# EAGLE design SSOP-28 v10 (EAGLE 6.2)
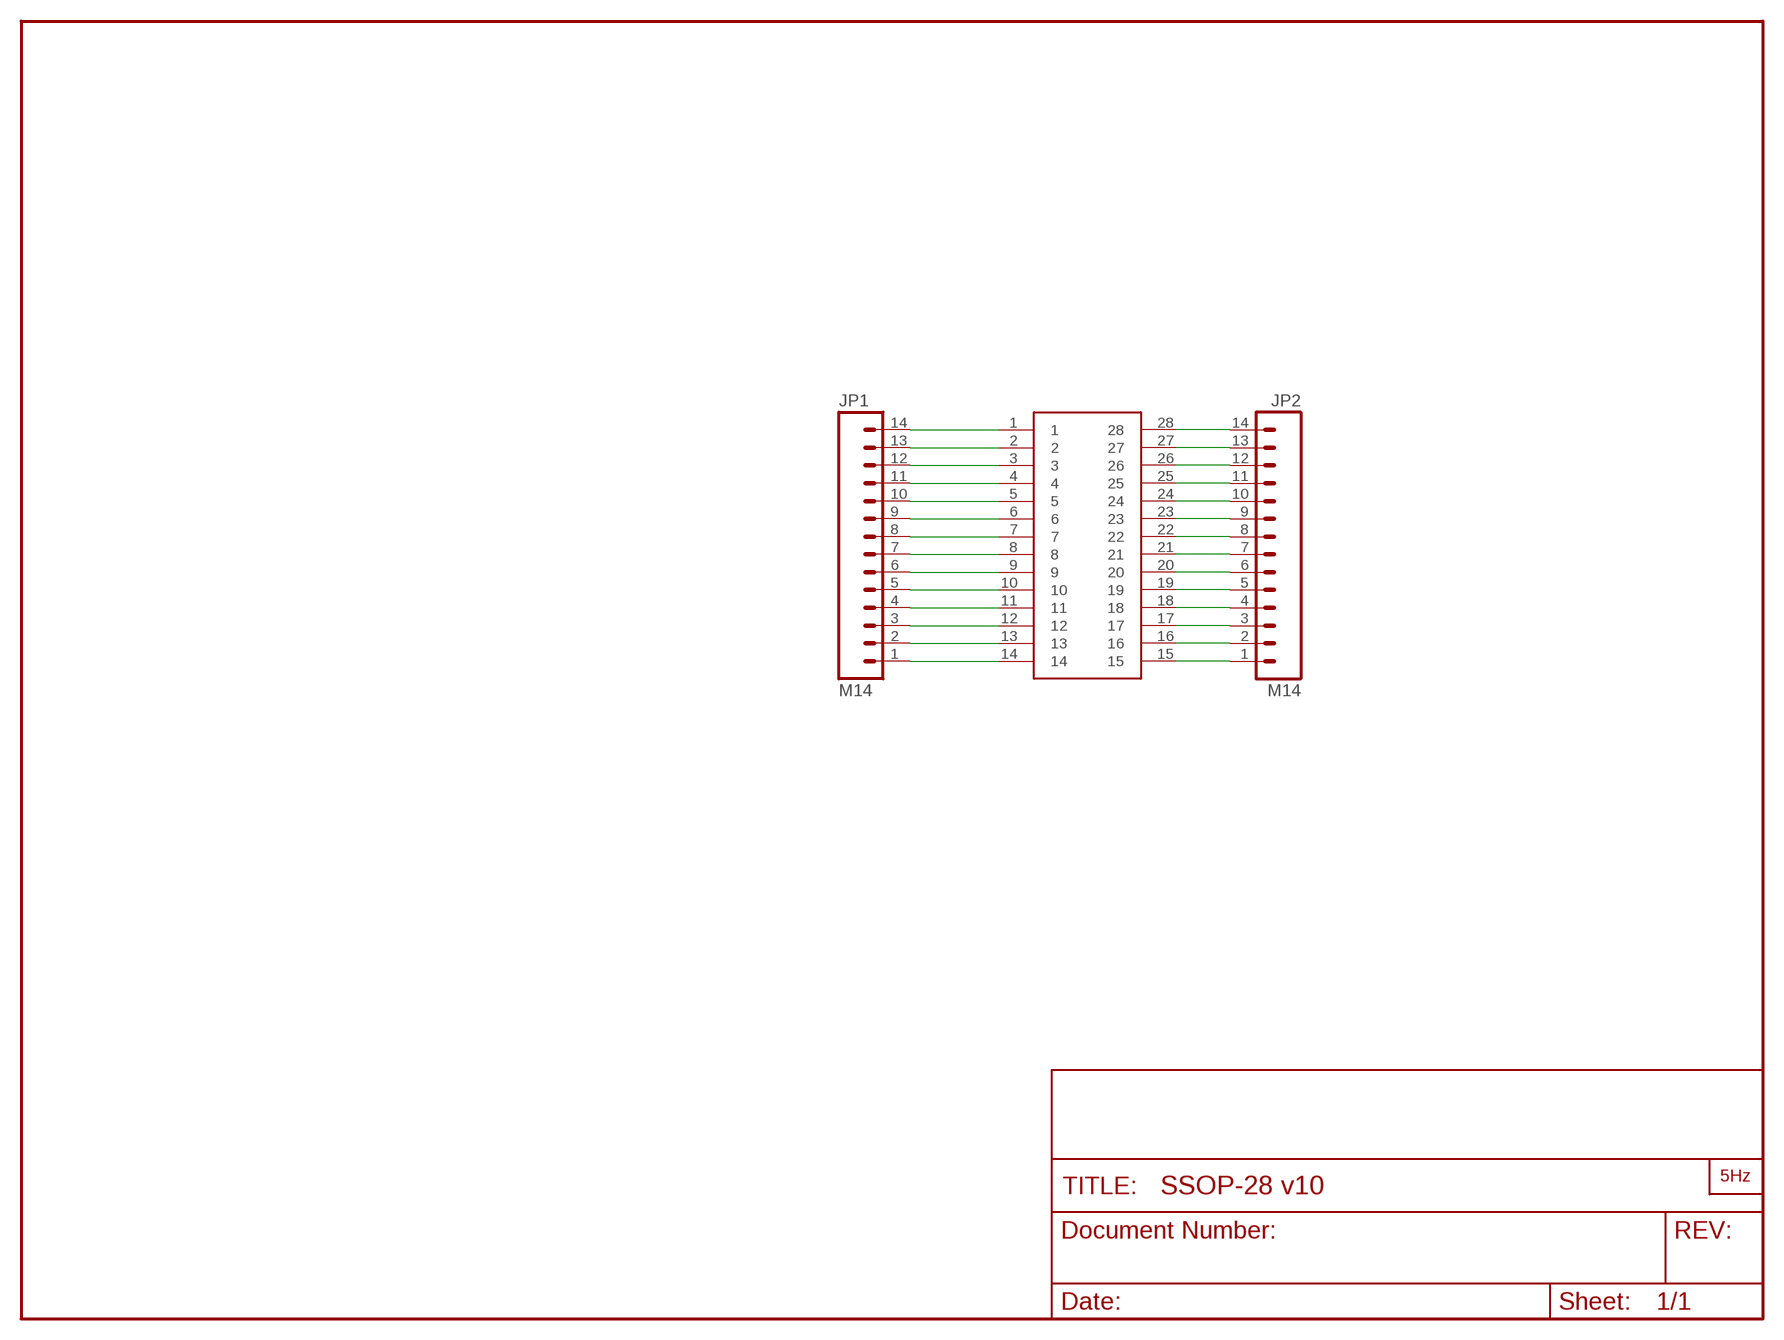
[diagram p0: schematic, sheet 1]

## Parts
JP1  M14  [1X14]
JP2  M14  [1X14]
U$1  SSOP28  [SSOP28DB]
U$2  LOGO2_SILK10MM  [LOGO2_10MM]

## Nets
N$1: JP1.1 U$1.14
N$2: JP1.2 U$1.13
N$3: JP1.3 U$1.12
N$4: JP1.4 U$1.11
N$5: JP1.5 U$1.10
N$6: JP1.6 U$1.9
N$7: JP1.7 U$1.8
N$8: JP1.8 U$1.7
N$9: JP1.9 U$1.6
N$10: JP1.10 U$1.5
N$11: JP1.11 U$1.4
N$12: JP1.12 U$1.3
N$13: JP1.13 U$1.2
N$14: JP1.14 U$1.1
N$15: JP2.1 U$1.15
N$16: JP2.2 U$1.16
N$17: JP2.3 U$1.17
N$18: JP2.4 U$1.18
N$19: JP2.5 U$1.19
N$20: JP2.6 U$1.20
N$21: JP2.7 U$1.21
N$22: JP2.8 U$1.22
N$23: JP2.9 U$1.23
N$24: JP2.10 U$1.24
N$25: JP2.11 U$1.25
N$26: JP2.12 U$1.26
N$27: JP2.13 U$1.27
N$28: JP2.14 U$1.28

## Library data of the parts
JP1 JP2 = SparkFun:M14: Header 14 Standard 14-pin 0.1" header. Use with straight break away headers (SKU : PRT-00116), right angle break away headers (PRT-00553), swiss pins (PRT-00743), machine pins (PRT-00117), and female headers (PRT-00115).
U$1 = SparkFun:SSOP28
U$2 = LOGO:LOGO2_SILK: PRINCIPAL

## Board
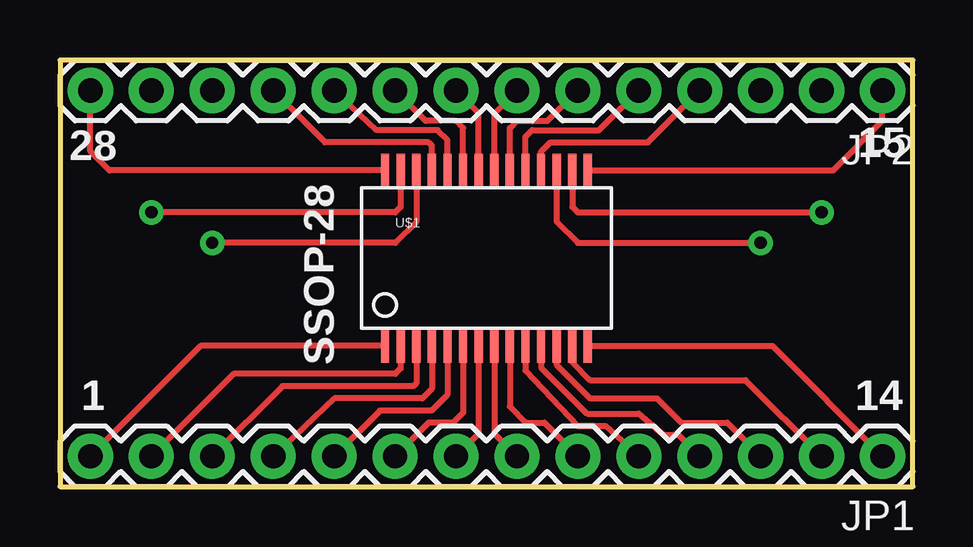
[diagram p1: board, top side]
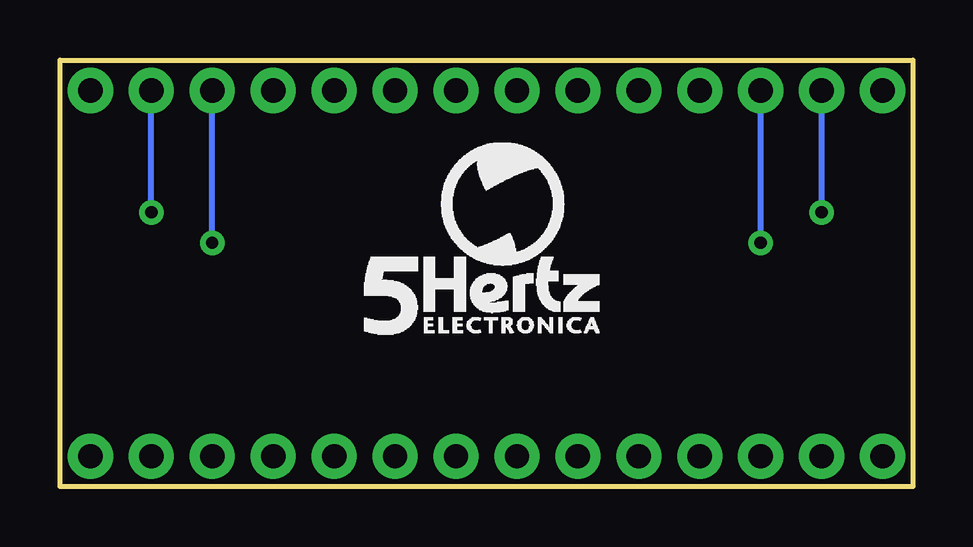
[diagram p2: board, bottom side, seen from below]

Size 35.56 x 17.78 mm. Coordinates in mm from the lower left corner, seen from the top.
Outline: 0,0 35.56,0 35.56,17.78 0,17.78 0,0
Copper layers (1*16): Top 0.035mm / dielectric 1.5mm / Bottom 0.035mm
Design rules: minimum track width 8mil, minimum drill 20mil, track to track 8mil, track to pad 8mil, pad to pad 8mil, via to via 8mil, smd to smd 8mil, copper to edge 10mil, drill to drill 8mil, minimum pad ring 12mil, minimum via ring 10mil, stop-mask expansion 4mil, vias tented up to drill 25mil, thermal gap 10mil

### Footprints (pad centres in the part's own frame; a part is rotated, then mirrored left to right if it is on the bottom)
1X14 = drill 1.016 pad 1.88: 1 0,0; 2 2.54,0; 3 5.08,0; 4 7.62,0; 5 10.16,0; 6 12.7,0; 7 15.24,0; 8 17.78,0; 9 20.32,0; 10 22.86,0; 11 25.4,0; 12 27.94,0; 13 30.48,0; 14 33.02,0
SSOP28DB = smd 0.348 x 1.397: 1 -4.225,-3.656; 2 -3.575,-3.656; 3 -2.925,-3.656; 4 -2.275,-3.656; 5 -1.625,-3.656; 6 -0.975,-3.656; 7 -0.325,-3.656; 8 0.325,-3.656; 9 0.975,-3.656; 10 1.625,-3.656; 11 2.275,-3.656; 12 2.925,-3.656; 13 3.575,-3.656; 14 4.225,-3.656; 15 4.225,3.656; 16 3.575,3.656; 17 2.925,3.656; 18 2.275,3.656; 19 1.625,3.656; 20 0.975,3.656; 21 0.325,3.656; 22 -0.325,3.656; 23 -0.975,3.656; 24 -1.625,3.656; 25 -2.275,3.656; 26 -2.925,3.656; 27 -3.575,3.656; 28 -4.225,3.656

### Placement (x,y rotation side)
JP1  34.29,1.27 180 top
JP2  34.29,16.51 180 top
U$1  17.78,9.53 0 top
U$2  22.86,6.35 0 bottom

### Tracks (layer width: path | path; a pad name or v marks a point on that pad's centre or on a via)
N$1
  Top 0.254: U$1.14 29.69,5.87 JP1.1
N$2
  Top 0.254: U$1.13 21.36,5.19 22.1,4.45 28.57,4.45 JP1.2
N$3
  Top 0.254: U$1.12 20.7,5.08 22.1,3.68 24.89,3.68 25.91,2.67 27.81,2.67 JP1.3
N$4
  Top 0.254: U$1.11 20.05,4.96 21.97,3.05 24.13,3.05 25.15,2.16 25.78,2.16 JP1.4
N$5
  Top 0.254: U$1.10 19.41,4.85 21.59,2.54 22.73,2.54 JP1.5
N$6
  Top 0.254: U$1.9 18.75,3.34 19.43,2.67 20.19,2.67 JP1.6
N$7
  Top 0.254: U$1.8 18.11,2.21 JP1.7
N$8
  Top 0.254: U$1.7 17.45,2.21 JP1.8
N$9
  Top 0.254: U$1.6 16.8,3.09 16.38,2.67 15.37,2.67 JP1.9
N$10
  Top 0.254: U$1.5 16.16,3.84 15.49,3.17 13.34,3.17 JP1.10
N$11
  Top 0.254: U$1.4 15.51,4.08 15.11,3.68 11.43,3.68 JP1.11
N$12
  Top 0.254: U$1.3 14.86,4.31 14.73,4.19 9.27,4.19 JP1.12
N$13
  Top 0.254: U$1.2 14.21,4.93 13.97,4.7 7.24,4.7 JP1.13
N$14
  Top 0.254: U$1.1 5.87,5.87 JP1.14
N$15
  Top 0.254: U$1.15 32.23,13.18 34.29,15.24 JP2.1
N$16  (via drill 0.51)
  Top 0.254: U$1.16 21.36,11.66 21.59,11.43 v31.75,11.43
  Bottom 0.254: v31.75,11.43 JP2.2
N$17  (via drill 0.51)
  Top 0.254: U$1.17 20.7,11.04 21.59,10.16 v29.21,10.16
  Bottom 0.254: v29.21,10.16 JP2.3
N$18
  Top 0.254: U$1.18 20.05,13.96 20.45,14.35 24.51,14.35 JP2.4
N$19
  Top 0.254: U$1.19 19.41,14.58 19.68,14.86 22.48,14.86 JP2.5
N$20
  Top 0.254: U$1.20 18.75,14.95 19.05,15.24 20.32,15.24 JP2.6
N$21
  Top 0.254: U$1.21 18.11,15.56 JP2.7
N$22
  Top 0.254: U$1.22 17.45,15.56 JP2.8
N$23
  Top 0.254: U$1.23 16.8,14.95 16.51,15.24 15.24,15.24 JP2.9
N$24
  Top 0.254: U$1.24 16.16,14.45 15.75,14.86 13.21,14.86 JP2.10
N$25
  Top 0.254: U$1.25 15.51,14.21 15.37,14.35 11.05,14.35 JP2.11
N$26  (via drill 0.51)
  Top 0.254: U$1.26 14.86,11.04 13.97,10.16 v6.35,10.16
  Bottom 0.254: v6.35,10.16 JP2.12
N$27  (via drill 0.51)
  Top 0.254: U$1.27 14.21,11.66 13.97,11.43 v3.81,11.43
  Bottom 0.254: v3.81,11.43 JP2.13
N$28
  Top 0.254: U$1.28 2.06,13.18 1.27,13.97 JP2.14

### Text on the board
tPlace: 28 | 15 | SSOP-28 | 1 | 14